# EAGLE design fischerbot (EAGLE 5.10)

## Sheet 1 of 2
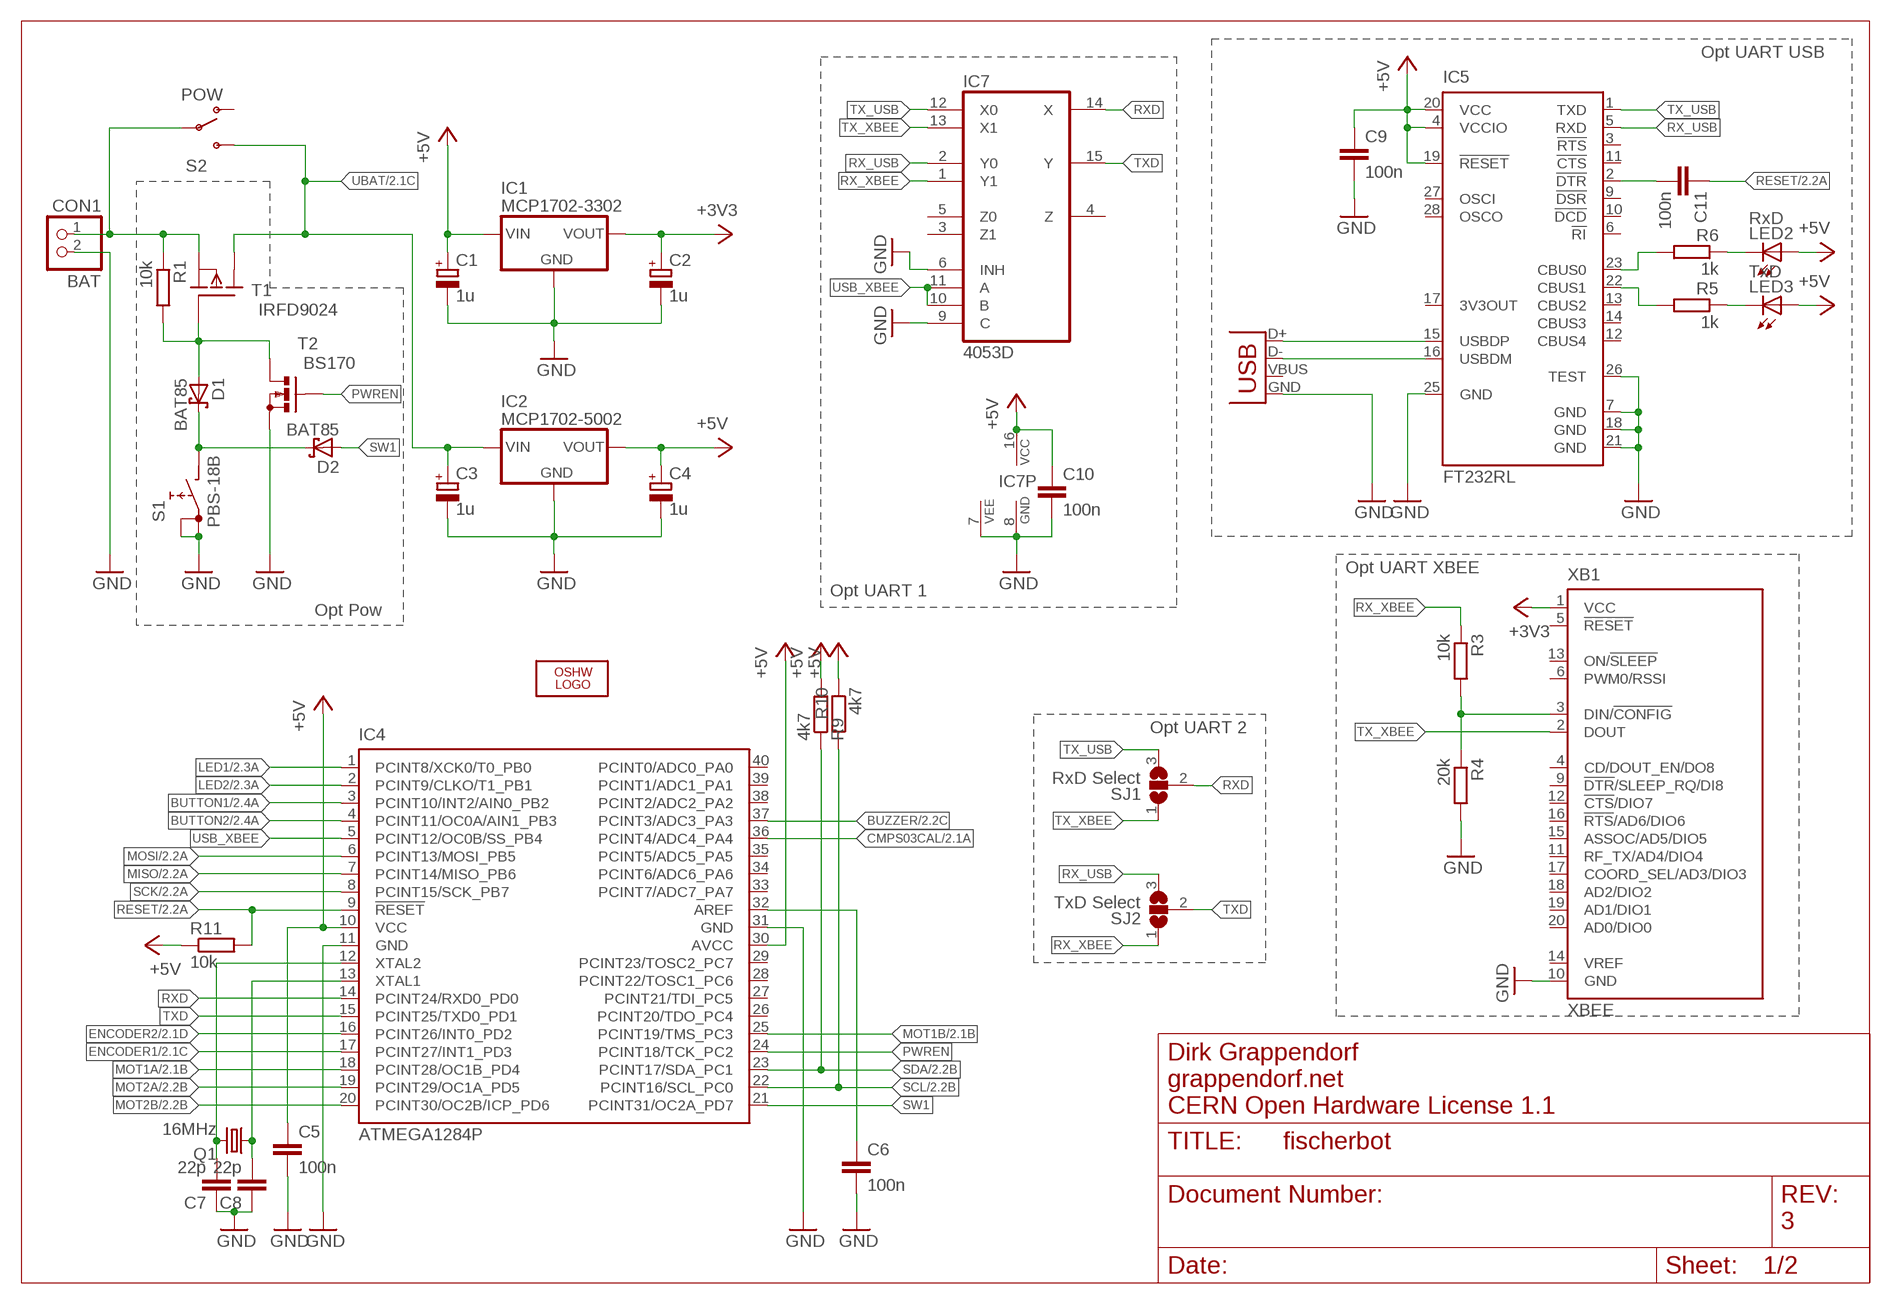
[diagram p0: schematic, sheet 1]

### Parts
C1  1u  CPOL-EUE2.5-5  [E2,5-5]
C2  1u  CPOL-EUE2.5-5  [E2,5-5]
C3  1u  CPOL-EUE2.5-5  [E2,5-5]
C4  1u  CPOL-EUE2.5-5  [E2,5-5]
C5  100n  C-EU025-024X044  [C025-024X044]
C6  100n  C-EU025-024X044  [C025-024X044]
C7  22p  C-EU025-024X044  [C025-024X044]
C8  22p  C-EU025-024X044  [C025-024X044]
C9  100n  C-EUC1206  [C1206]
C10  100n  C-EUC1206  [C1206]
C11  100n  C-EUC1206  [C1206]
CON1  BAT  PINHD-1X2_2.54-90°  [1X02/90]
D1  BAT85  1N5817-B  [DO41-7.6]
D2  BAT85  1N5817-B  [DO41-7.6]
IC1  MCP1702-3302  MCP1702  [MCP1702]
IC2  MCP1702-5002  MCP1702  [MCP1702]
IC4  ATMEGA1284P  ATMEGA644-20PU  [DIL40]
IC5  FT232RL  [SSOP28]
IC7  4053D  [SO16]
LED2  RxD  LEDCHIPLED_1206  [CHIPLED_1206]
LED3  TxD  LEDCHIPLED_1206  [CHIPLED_1206]
LOGO1  OSHW_LOGO_10MILX0350-NT  [OSHW_10X350_NOTEXT]
Q1  16MHz  CRYSTALHC49U-V  [HC49U-V]
R1  10k  R-EU_0204/7  [0204/7]
R3  10k  R-EU_0204/7  [0204/7]
R4  20k  R-EU_0204/7  [0204/7]
R5  1k  R-EU_R1206  [R1206]
R6  1k  R-EU_R1206  [R1206]
R9  4k7  R-EU_0204/7  [0204/7]
R10  4k7  R-EU_0204/7  [0204/7]
R11  10k  R-EU_0204/7  [0204/7]
S1  PBS-18B  [PBS-18B]
S2  POW  SWITCH-SPSTPTH  [SWITCH-SPDT]
SJ1  RxD Select  SJ2W  [SJ_2]
SJ2  TxD Select  SJ2W  [SJ_2]
T1  IRFD9024  [DIL04]
T2  BS170  [SOT54E]
X1  USB-SMD-NS  [USB-MINIB-NOSTOP]
XB1  XBEE  [XBEE]

### Nets
+3V3: C2.+ IC1.VOUT(OUT) XB1.1(VCC)
+5V: C1.+ C4.+ C5.1 C9.1 C10.1 IC1.VIN(IN) IC2.VOUT(OUT) IC4.10(VCC) IC4.30(AVCC) IC5.4(VCCIO) IC5.19(!RESET) IC5.20(VCC) IC7.16(VCC) LED2.A LED3.A R9.2 R10.1 R11.1 ; also sheet 2
BUTTON1: IC4.3(PCINT10/INT2/AIN0_PB2) ; also sheet 2
BUTTON2: IC4.4(PCINT11/OC0A/AIN1_PB3) ; also sheet 2
BUZZER: IC4.37(PCINT3/ADC3_PA3) ; also sheet 2
CMPS03CAL: IC4.36(PCINT4/ADC4_PA4) ; also sheet 2
ENCODER1: IC4.17(PCINT27/INT1_PD3) ; also sheet 2
ENCODER2: IC4.16(PCINT26/INT0_PD2) ; also sheet 2
GND: C1.- C2.- C3.- C4.- C5.2 C6.2 C7.1 C8.1 C9.2 C10.2 CON1.2 IC1.GND IC2.GND IC4.11(GND) IC4.31(GND) IC5.7(GND) IC5.18(GND) IC5.21(GND) IC5.25(GND) IC5.26(TEST) IC7.6(INH) IC7.7(VEE) IC7.8(GND) IC7.9(C) R4.2 S1.A S1.A1 T2.S X1.GND XB1.10(GND) ; also sheet 2
LED1: IC4.1(PCINT8/XCK0/T0_PB0) ; also sheet 2
LED2: IC4.2(PCINT9/CLKO/T1_PB1) ; also sheet 2
MISO: IC4.7(PCINT14/MISO_PB6) ; also sheet 2
MOSI: IC4.6(PCINT13/MOSI_PB5) ; also sheet 2
MOT1A: IC4.18(PCINT28/OC1B_PD4) ; also sheet 2
MOT1B: IC4.25(PCINT19/TMS_PC3) ; also sheet 2
MOT2A: IC4.19(PCINT29/OC1A_PD5) ; also sheet 2
MOT2B: IC4.20(PCINT30/OC2B/ICP_PD6) ; also sheet 2
N$1: C6.1 IC4.32(AREF)
N$3: D1.A R1.2 T1.1(G) T2.D
N$4: CON1.1 R1.1 S2.2(P) T1.2(S)
N$5: D1.C D2.C S1.B
N$7: R3.2 R4.1 XB1.3(DIN/!CONFIG)
N$10: IC5.23(CBUS0) R6.2
N$11: C7.2 IC4.12(XTAL2) Q1.2
N$12: IC5.22(CBUS1) R5.2
N$13: IC5.16(USBDM) X1.D-
N$14: IC5.15(USBDP) X1.D+
N$15: C8.2 IC4.13(XTAL1) Q1.1
N$16: LED2.C R6.1
N$17: LED3.C R5.1
N$26: C11.2 IC5.2(!DTR)
PWREN: IC4.24(PCINT18/TCK_PC2) T2.G
RESET: C11.1 IC4.9(!RESET) R11.2 ; also sheet 2
RX_USB: IC5.5(RXD) IC7.2(Y0) SJ2.3
RX_XBEE: IC7.1(Y1) R3.1 SJ2.1
RXD: IC4.14(PCINT24/RXD0_PD0) IC7.14(X) SJ1.2
SCK: IC4.8(PCINT15/SCK_PB7) ; also sheet 2
SCL: IC4.22(PCINT16/SCL_PC0) R10.2 ; also sheet 2
SDA: IC4.23(PCINT17/SDA_PC1) R9.1 ; also sheet 2
SW1: D2.A IC4.21(PCINT31/OC2A_PD7)
TX_USB: IC5.1(TXD) IC7.12(X0) SJ1.3
TX_XBEE: IC7.13(X1) SJ1.1 XB1.2(DOUT)
TXD: IC4.15(PCINT25/TXD0_PD1) IC7.15(Y) SJ2.2
UBAT: C3.+ IC2.VIN(IN) S2.3(S) T1.3(D1) ; also sheet 2
USB_XBEE: IC4.5(PCINT12/OC0B/SS_PB4) IC7.10(B) IC7.11(A)
Unconnected: IC4.26(PCINT20/TDO_PC4) IC4.27(PCINT21/TDI_PC5) IC4.28(PCINT22/TOSC1_PC6) IC4.29(PCINT23/TOSC2_PC7) IC4.33(PCINT7/ADC7_PA7) IC4.34(PCINT6/ADC6_PA6) IC4.35(PCINT5/ADC5_PA5) IC4.38(PCINT2/ADC2_PA2) IC4.39(PCINT1/ADC1_PA1) IC4.40(PCINT0/ADC0_PA0) IC5.3(!RTS) IC5.6(!RI) IC5.9(!DSR) IC5.10(!DCD) IC5.11(!CTS) IC5.12(CBUS4) IC5.13(CBUS2) IC5.14(CBUS3) IC5.17(3V3OUT) IC5.27(OSCI) IC5.28(OSCO) IC7.3(Z1) IC7.4(Z) IC7.5(Z0) S2.1(O) T1.4(D) X1.VBUS XB1.4(CD/DOUT_EN/DO8) XB1.5(!RESET) XB1.6(PWM0/RSSI) XB1.9(!DTR!/SLEEP_RQ/DI8) XB1.11(RF_TX/AD4/DIO4) XB1.12(!CTS!/DIO7) XB1.13(ON/!SLEEP) XB1.14(VREF) XB1.15(ASSOC/AD5/DIO5) XB1.16(!RTS!/AD6/DIO6) XB1.17(COORD_SEL/AD3/DIO3) XB1.18(AD2/DIO2) XB1.19(AD1/DIO1) XB1.20(AD0/DIO0)

### Notes on the sheet
- Opt UART USB
- Opt UART XBEE
- Opt UART 1
- Opt Pow
- Opt UART 2
- Dirk Grappendorf
- grappendorf.net
- CERN Open Hardware License 1.1
- 3

## Sheet 2 of 2
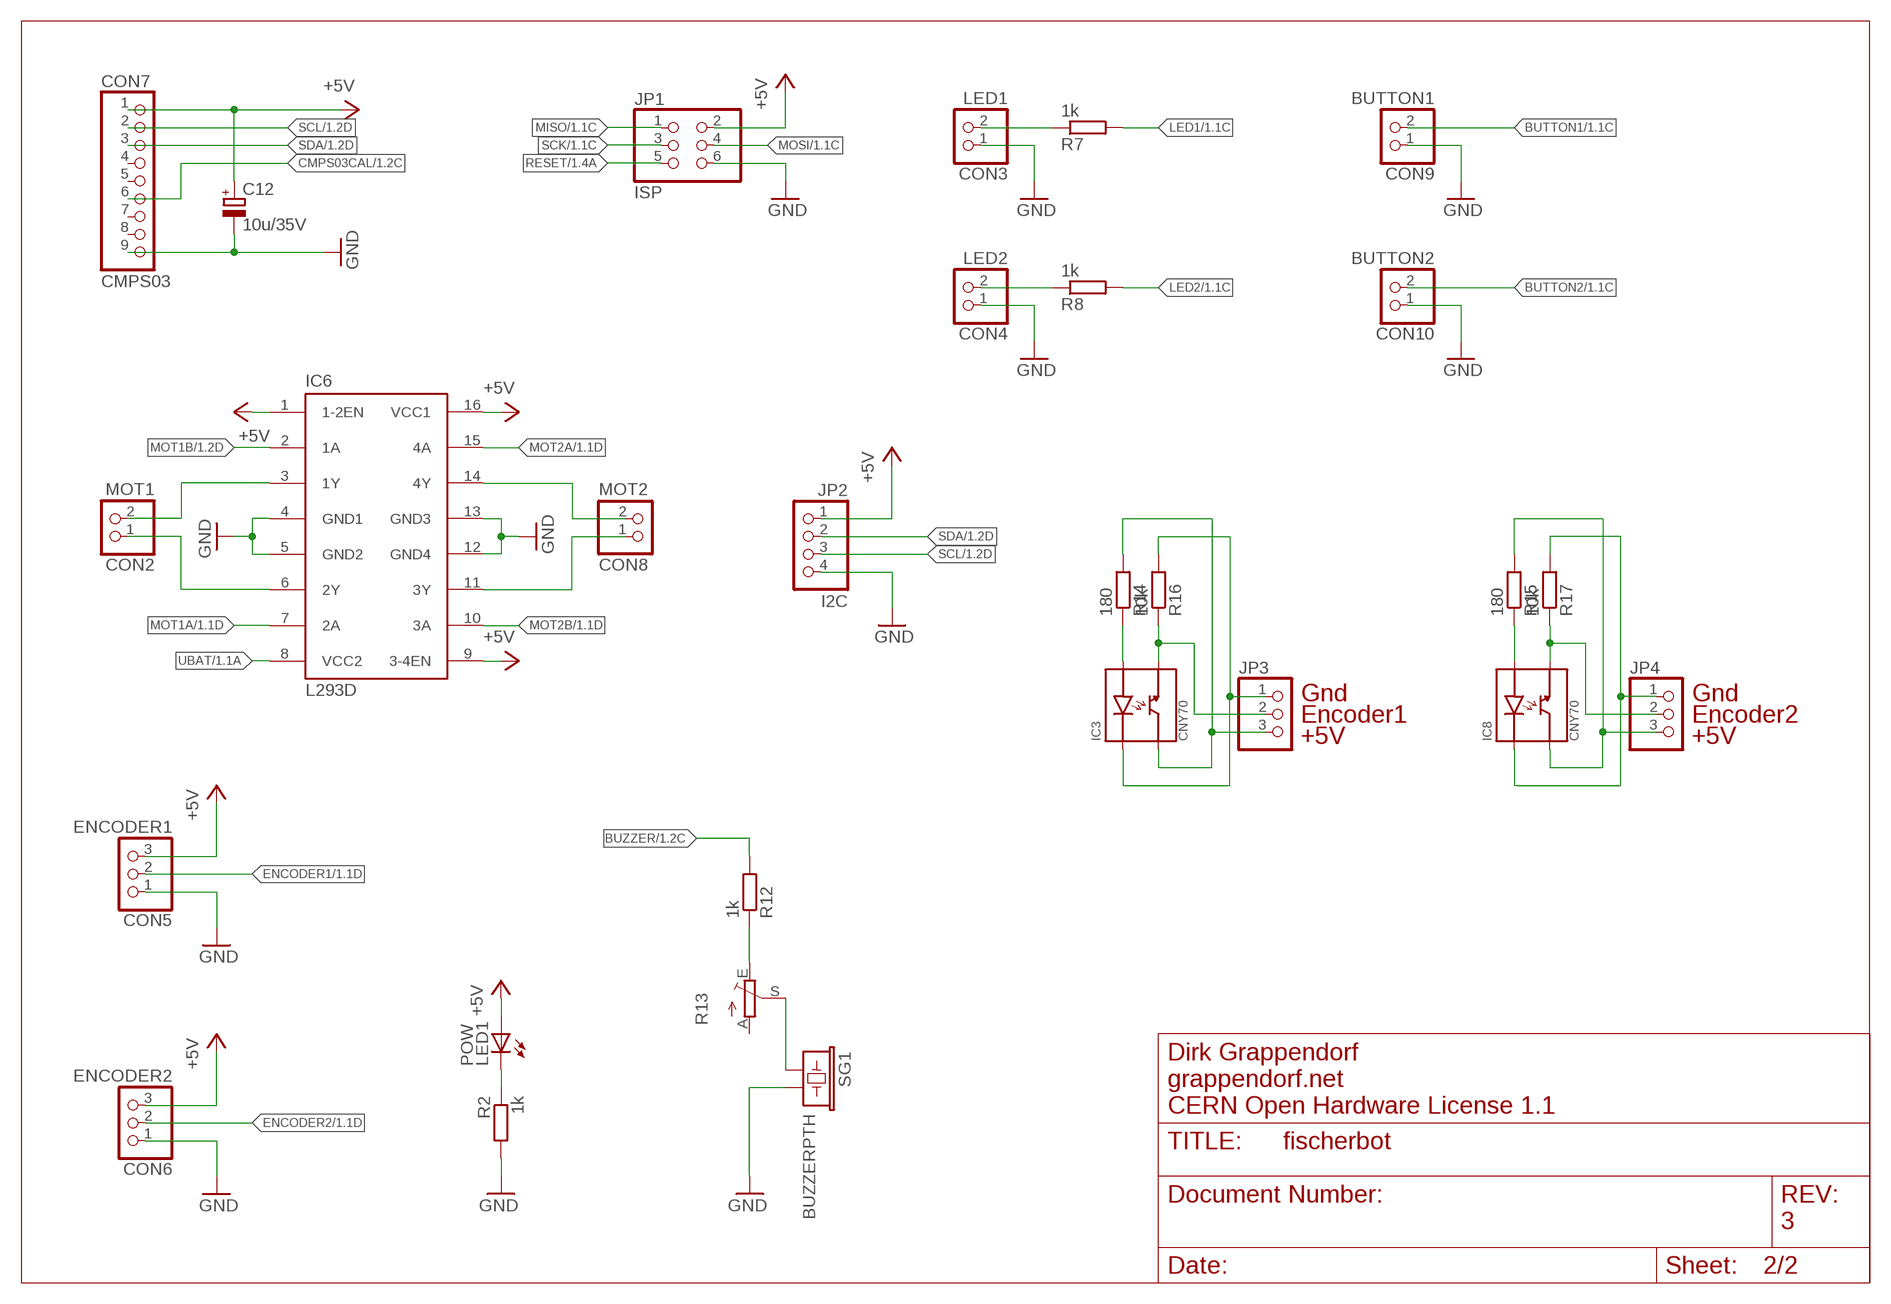
[diagram p1: schematic, sheet 2]

### Parts
C12  10u/35V  CPOL-EUE2.5-5  [E2,5-5]
CON2  MOT1  PINHD-1X2/90  [1X02/90]
CON3  LED1  PINHD-1X2/90  [1X02/90]
CON4  LED2  PINHD-1X2/90  [1X02/90]
CON5  ENCODER1  PINHD-1X3/90  [1X03/90]
CON6  ENCODER2  PINHD-1X3/90  [1X03/90]
CON7  CMPS03  PINHD-1X9  [1X09]
CON8  MOT2  PINHD-1X2/90  [1X02/90]
CON9  BUTTON1  PINHD-1X2/90  [1X02/90]
CON10  BUTTON2  PINHD-1X2/90  [1X02/90]
IC3  CNY70  [CNY70]
IC6  L293D  [DIL16]
IC8  CNY70  [CNY70]
JP1  ISP  PINHD-2X3_2.54  [2X03]
JP2  I2C  PINHD-1X4/90  [1X04/90]
JP3  PINHD-1X3  [1X03]
JP4  PINHD-1X3  [1X03]
LED1  POW  LED3MM  [LED3MM]
R2  1k  R-EU_0204/7  [0204/7]
R7  1k  R-EU_0204/7  [0204/7]
R8  1k  R-EU_0204/7  [0204/7]
R12  1k  R-EU_0204/7  [0204/7]
R13  TRIM_EU-ECP10S  [ECP10S]
R14  180  R-EU_0204/7  [0204/7]
R15  180  R-EU_0204/7  [0204/7]
R16  10k  R-EU_0204/7  [0204/7]
R17  10k  R-EU_0204/7  [0204/7]
SG1  BUZZERPTH  [BUZZER-12MM]

### Nets
+5V: C12.+ CON5.3 CON6.3 CON7.1 IC6.1(1-2EN) IC6.9(3-4EN) IC6.16(VCC1) JP1.2 JP2.1 LED1.A ; also sheet 1
BUTTON1: CON9.2 ; also sheet 1
BUTTON2: CON10.2 ; also sheet 1
BUZZER: R12.2 ; also sheet 1
CMPS03CAL: CON7.6 ; also sheet 1
ENCODER1: CON5.2 ; also sheet 1
ENCODER2: CON6.2 ; also sheet 1
GND: C12.- CON3.1 CON4.1 CON5.1 CON6.1 CON7.9 CON9.1 CON10.1 IC6.4(GND1) IC6.5(GND2) IC6.12(GND4) IC6.13(GND3) JP1.6 JP2.4 R2.2 SG1.- ; also sheet 1
LED1: R7.2 ; also sheet 1
LED2: R8.2 ; also sheet 1
MISO: JP1.1 ; also sheet 1
MOSI: JP1.4 ; also sheet 1
MOT1A: IC6.7(2A) ; also sheet 1
MOT1B: IC6.2(1A) ; also sheet 1
MOT2A: IC6.15(4A) ; also sheet 1
MOT2B: IC6.10(3A) ; also sheet 1
N$2: CON2.2 IC6.3(1Y)
N$6: LED1.K(C) R2.1
N$8: CON3.2 R7.1
N$9: CON4.2 R8.1
N$20: CON2.1 IC6.6(2Y)
N$21: CON8.2 IC6.14(4Y)
N$22: CON8.1 IC6.11(3Y)
N$30: R13.S SG1.+
N$31: R12.1 R13.E
N$32: IC3.EA R14.1
N$33: IC8.EA R15.1
N$34: IC3.DE JP3.2 R16.1
N$35: IC8.DE JP4.2 R17.1
N$40: IC8.EK JP4.1 R17.2
N$41: IC8.DC JP4.3 R15.2
N$46: IC3.DC JP3.3 R14.2
N$48: IC3.EK JP3.1 R16.2
RESET: JP1.5 ; also sheet 1
SCK: JP1.3 ; also sheet 1
SCL: CON7.2 JP2.3 ; also sheet 1
SDA: CON7.3 JP2.2 ; also sheet 1
UBAT: IC6.8(VCC2) ; also sheet 1
Unconnected: CON7.4 CON7.5 CON7.7 CON7.8 R13.A

### Notes on the sheet
- Gnd | Gnd
- Encoder1 | Encoder2
- +5V | +5V
- Dirk Grappendorf
- grappendorf.net
- CERN Open Hardware License 1.1
- 3

## Library data of the parts
C1-C4 C12 = rcl:CPOL-EU: POLARIZED CAPACITOR, European symbol
C5-C11 = rcl:C-EU: CAPACITOR, European symbol
CON1 = pinhead-1:PINHD-1X2: PIN HEADER
CON2-CON4 CON8-CON10 = pinhead:PINHD-1X2: PIN HEADER
CON5 CON6 JP3 JP4 = pinhead:PINHD-1X3: PIN HEADER
CON7 = pinhead:PINHD-1X9: PIN HEADER
D1 D2 = diode:1N581*: 1.0A SCHOTTKY BARRIER RECTIFIER Source: http://www.diodes.com/datasheets/ds23001.pdf
IC1 IC2 = grapelabs:MCP1702: VOLTAGE REGULATOR
IC3 IC8 = CNY70:CNY70: CNY70 (Vishay) Reflexkoppler
IC4 = atmel:ATMEGA644-*PU: 8-bit Microcontroller with 64K Bytes In-System Programmable Flash Auto generated by make-symbol-device-package-bsdl.ulp Rev. 34 Source: http://www.atmel.com/dyn/resources/prod_documents/doc2593.pdf
IC5 = ftdichip:FT232R: Source: http://www.ftdichip.com/Documents/DataSheets/DS_FT232R_v104.pdf
IC6 = st-microelectronics:L293D: PUSH-PULL 4 CHANNEL DRIVER
IC7 = 40xx:4053: Triple 2-channel ANALOG MULTIPLEXER
JP1 = pinhead-1:PINHD-2X3: PIN HEADER
JP2 = pinhead:PINHD-1X4: PIN HEADER
LED1-LED3 = led:LED: LED OSRAM: - CHIPLED LG R971, LG N971, LY N971, LG Q971, LY Q971, LO R971, LY R971 LH N974, LH R974 LS Q976, LO Q976, LY Q976 LO Q996 - Hyper CHIPLED LW Q18S LB Q993, LB Q99A, LB R99A - SideLED LS A670, LO A670, LY A670, LG A670, LP A670 LB A673, LV A673, LT A673, LW A673 LH A674 LY A675 LS A676, LA A676, LO A676, LY A676, LW A676 LS A679, LY A679, LG A679 - Hyper Micro SIDELED® LS Y876, LA Y876, LO Y876, LY Y876 LT Y87S - SmartLED LW L88C, LW L88S LB L89C, LB L89S, LG L890 LS L89K, LO L89K, LY L89K LS L896, LA L896, LO L896, LY L896 - TOPLED LS T670, LO T670, LY T670, LG T670, LP T670 LSG T670, LSP T670, LSY T670, LOP T670, LYG T670 LG T671, LOG T671, LSG T671 LB T673, LV T673, LT T673, LW T673 LH T674 LS T676, LA T676, LO T676, LY T676, LB T676, LH T676, LSB T676, LW T676 LB T67C, LV T67C, LT T67C, LS T67K, LO T67K, LY T67K, LW E67C LS E67B, LA E67B, LO E67B, LY E67B, LB E67C, LV E67C, LT E67C LW T67C LS T679, LY T679, LG T679 LS T770, LO T770, LY T770, LG T770, LP T770 LB T773, LV T773, LT T773, LW T773 LH T774 LS E675, LA E675, LY E675, LS T675 LS T776, LA T776, LO T776, LY T776, LB T776 LHGB T686 LT T68C, LB T68C - Hyper Mini TOPLED® LB M676 - Mini TOPLED Santana® LG M470 LS M47K, LO M47K, LY M47K Source: http://www.osram.convergy.de LUXEON: - LUMILED® LXK2-PW12-R00, LXK2-PW12-S00, LXK2-PW14-U00, LXK2-PW14-V00 LXK2-PM12-R00, LXK2-PM12-S00, LXK2-PM14-U00 LXK2-PE12-Q00, LXK2-PE12-R00, LXK2-PE12-S00, LXK2-PE14-T00, LXK2-PE14-U00 LXK2-PB12-K00, LXK2-PB12-L00, LXK2-PB12-M00, LXK2-PB14-N00, LXK2-PB14-P00, LXK2-PB14-Q00 LXK2-PR12-L00, LXK2-PR12-M00, LXK2-PR14-Q00, LXK2-PR14-R00 LXK2-PD12-Q00, LXK2-PD12-R00, LXK2-PD12-S00 LXK2-PH12-R00, LXK2-PH12-S00 LXK2-PL12-P00, LXK2-PL12-Q00, LXK2-PL12-R00 Source: www.luxeon.com KINGBRIGHT: KA-3528ASYC Source: www.kingbright.com
LOGO1 = OSHW:OSHW_LOGO_10MIL
Q1 = crystal:CRYSTAL: CRYSTAL
R1-R12 R14-R17 = rcl:R-EU_: RESISTOR, European symbol
R13 = pot:TRIM_EU-: POTENTIOMETER
S1 = grapelabs:PBS-18B: PUSH SWITCH www.radiohm.com
S2 = SparkFun:SWITCH-SPST: SPST Switch Simple slide switch. Spark Fun Electronics SKU : COM-00102
SG1 = SparkFun:BUZZER: Buzzer 12mm Spark Fun Electronics SKU : Comp-Buzzer
SJ1 SJ2 = jumper:SJ2W: SMD solder JUMPER
T1 = grapelabs:IRFD9024: P-Channel Enhancement MOSFET
T2 = transistor-small-signal:BS170: N-CHANNEL MOS FET
X1 = SparkFun:USB: USB Connectors USB-B-PTH is fully proven SKU : PRT-00139 USB-miniB is fully proven SKU : PRT-00587 USB-A-PCB is untested. USB-A-H is throughly reviewed, but untested. Spark Fun Electronics SKU : PRT-00437 USB-B-SMT is throughly reviewed, but untested. Needs silkscreen touching up. USB-A-S has not been used/tested USB-MB-H has not been used/tested
XB1 = maxstream:XBEE: XBee (TM) /XBee-PRO(TM) OEM RF Modules Source: MaxStream, Inc. xbee_productmanual.pdf

## Board
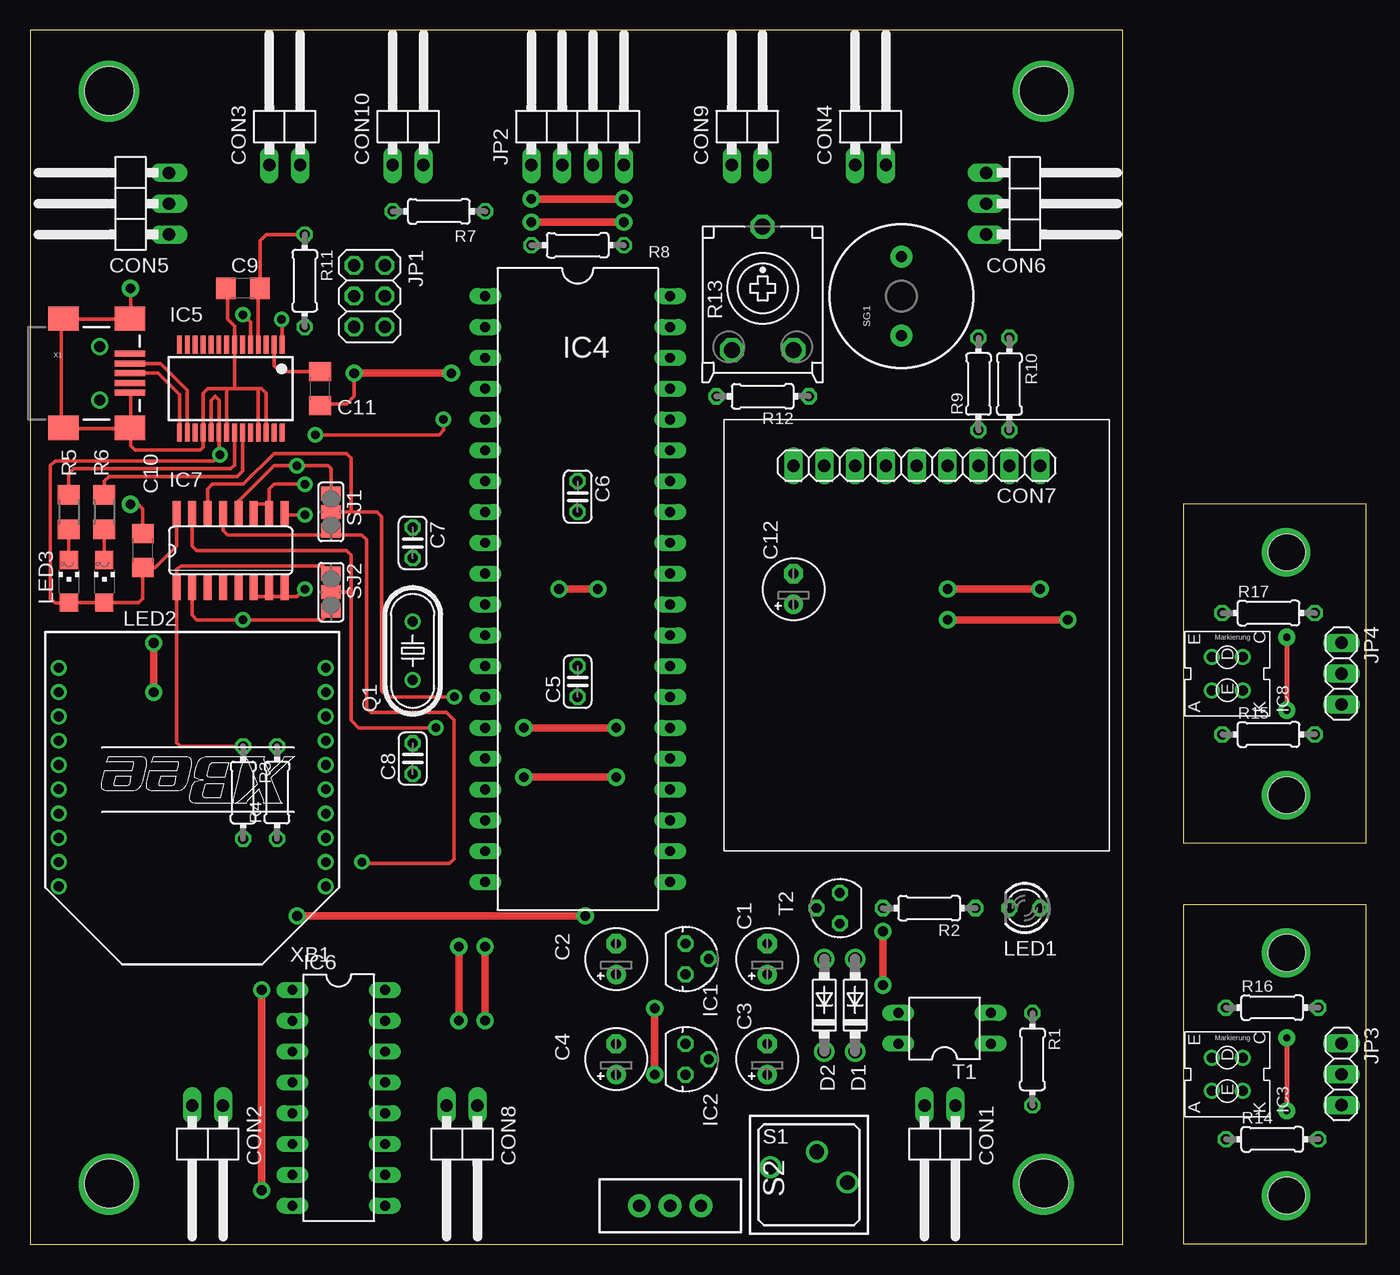
[diagram p2: board, top side]
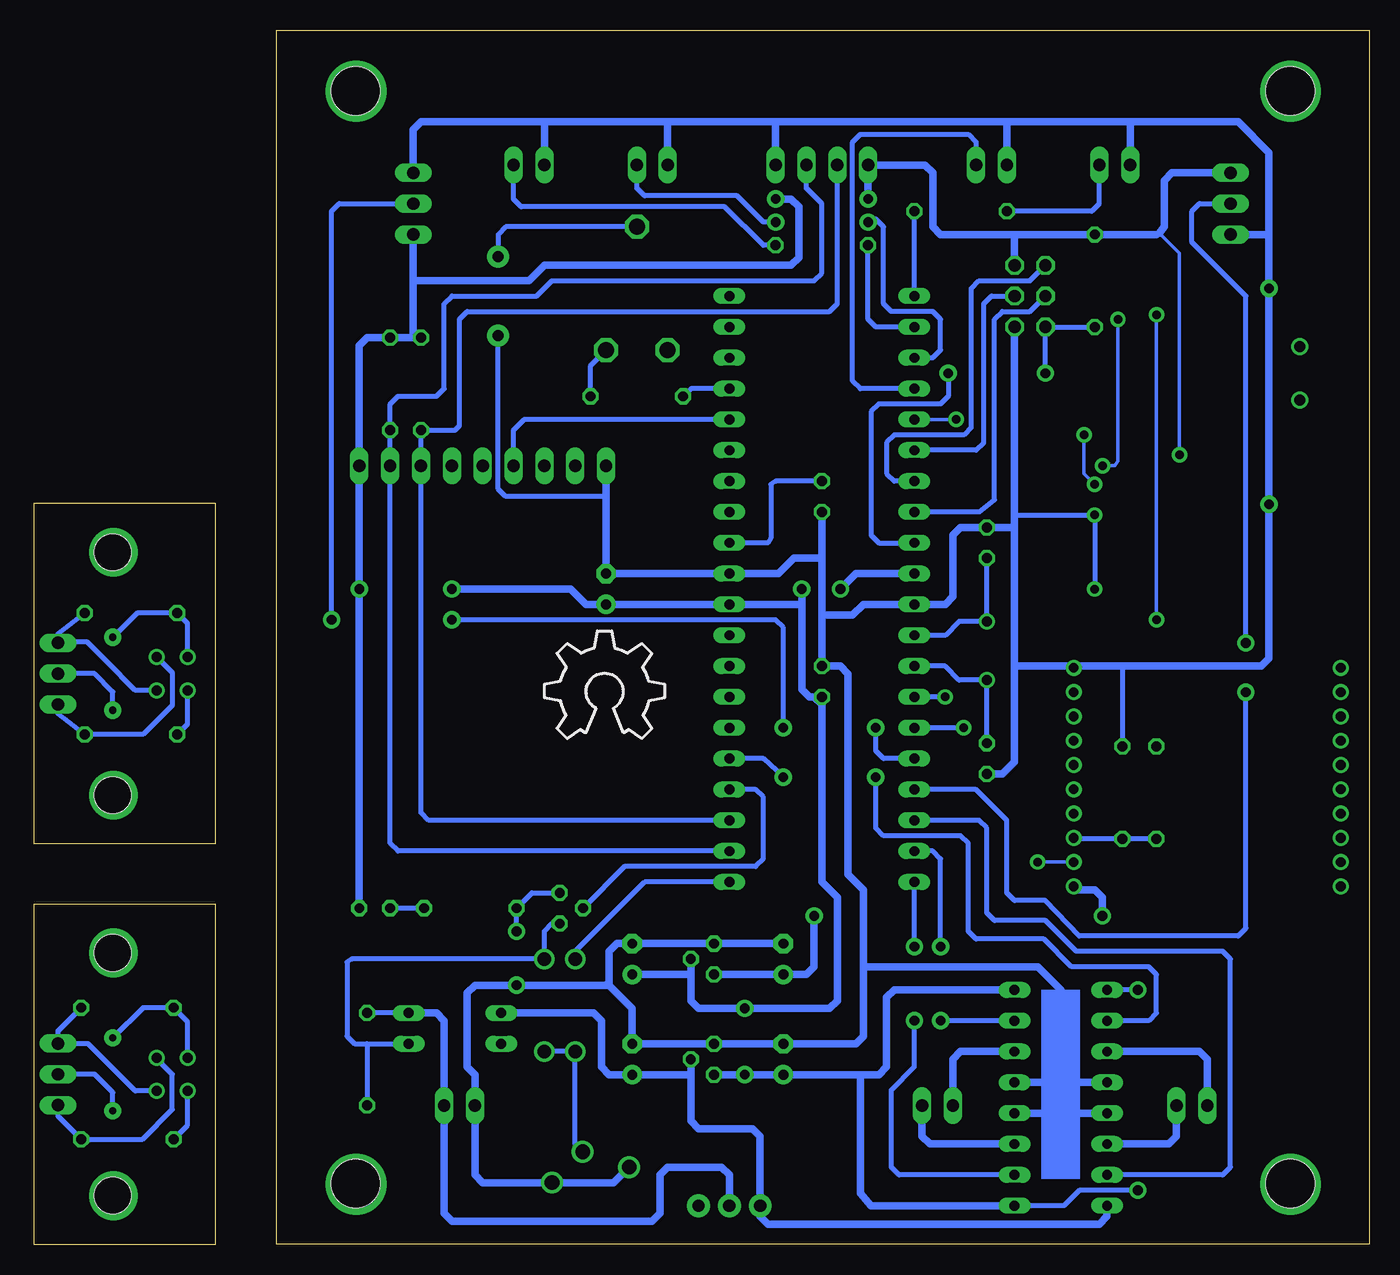
[diagram p3: board, bottom side, seen from below]

Size 110 x 100 mm. Coordinates in mm from the lower left corner, seen from the top.
Outline: 0,0 90,0 90,100 0,100 0,0
Outline: 95,61 110,61 110,33 95,33 95,61
Outline: 95,28 110,28 110,0 95,0 95,28
Copper layers (1*16): Top 0.035mm / dielectric 1.5mm / Bottom 0.035mm
Design rules "default *": minimum track width 10mil, minimum drill 24mil, track to track 8mil, track to pad 8mil, pad to pad 8mil, via to via 8mil, smd to smd 8mil, copper to edge 40mil, drill to drill 8mil, minimum pad ring 10mil, minimum via ring 8mil, stop-mask expansion 6mil, vias tented up to drill 0mil, thermal gap 10mil
Holes 4 mm at 6.5,95 6.5,5 83.5,5 83.5,95
Holes 3 mm at 103.5,57 103.5,37 103.5,24 103.5,4

### Footprints (pad centres in the part's own frame; a part is rotated, then mirrored left to right if it is on the bottom)
E2,5-5 = drill 0.813 pad 1.6 round: + -1.27,0 | drill 0.813 pad 1.6 octagon: - 1.27,0
C025-024X044 = drill 0.813 octagon: 1 -1.27,0; 2 1.27,0
C1206 = smd 1.6 x 1.8: 1 -1.4,0; 2 1.4,0
1X02/90 = drill 1.016 long: 1 -2.54,-3.81; 2 0,-3.81
1X02/90' = drill 1.016 long: 1 -1.27,-3.81; 2 1.27,-3.81
1X03/90 = drill 1.016 long: 1 -2.54,-3.81; 2 0,-3.81; 3 2.54,-3.81
1X09 = drill 1.016 long: 1 -10.16,0; 2 -7.62,0; 3 -5.08,0; 4 -2.54,0; 5 0,0; 6 2.54,0; 7 5.08,0; 8 7.62,0; 9 10.16,0
DO41-7.6 = drill 1.1 pad 1.7 round: A 3.81,0; C -3.81,0
MCP1702 = drill 0.813 octagon: GND -1.27,0; VIN 0,1.905; VOUT 1.27,0
CNY70 = drill 0.813 round: DC 1.37,-1.27; DE 1.37,1.27; EA -1.37,1.27; EK -1.37,-1.27
DIL40 = drill 0.813 long: 1 -24.13,-7.62; 2 -21.59,-7.62; 3 -19.05,-7.62; 4 -16.51,-7.62; 5 -13.97,-7.62; 6 -11.43,-7.62; 7 -8.89,-7.62; 8 -6.35,-7.62; 9 -3.81,-7.62; 10 -1.27,-7.62; 11 1.27,-7.62; 12 3.81,-7.62; 13 6.35,-7.62; 14 8.89,-7.62; 15 11.43,-7.62; 16 13.97,-7.62; 17 16.51,-7.62; 18 19.05,-7.62; 19 21.59,-7.62; 20 24.13,-7.62; 21 24.13,7.62; 22 21.59,7.62; 23 19.05,7.62; 24 16.51,7.62; 25 13.97,7.62; 26 11.43,7.62; 27 8.89,7.62; 28 6.35,7.62; 29 3.81,7.62; 30 1.27,7.62; 31 -1.27,7.62; 32 -3.81,7.62; 33 -6.35,7.62; 34 -8.89,7.62; 35 -11.43,7.62; 36 -13.97,7.62; 37 -16.51,7.62; 38 -19.05,7.62; 39 -21.59,7.62; 40 -24.13,7.62
SSOP28 = smd 0.4 x 1.5: 1 -4.225,-3.625; 2 -3.575,-3.625; 3 -2.925,-3.625; 4 -2.275,-3.625; 5 -1.625,-3.625; 6 -0.975,-3.625; 7 -0.325,-3.625; 8 0.325,-3.625; 9 0.975,-3.625; 10 1.625,-3.625; 11 2.275,-3.625; 12 2.925,-3.625; 13 3.575,-3.625; 14 4.225,-3.625; 15 4.225,3.625; 16 3.575,3.625; 17 2.925,3.625; 18 2.275,3.625; 19 1.625,3.625; 20 0.975,3.625; 21 0.325,3.625; 22 -0.325,3.625; 23 -0.975,3.625; 24 -1.625,3.625; 25 -2.275,3.625; 26 -2.925,3.625; 27 -3.575,3.625; 28 -4.225,3.625
DIL16 = drill 0.813 long: 1 -8.89,-3.81; 2 -6.35,-3.81; 3 -3.81,-3.81; 4 -1.27,-3.81; 5 1.27,-3.81; 6 3.81,-3.81; 7 6.35,-3.81; 8 8.89,-3.81; 9 8.89,3.81; 10 6.35,3.81; 11 3.81,3.81; 12 1.27,3.81; 13 -1.27,3.81; 14 -3.81,3.81; 15 -6.35,3.81; 16 -8.89,3.81
SO16 = smd 0.66 x 2.032: 1 -4.445,-3.073; 2 -3.175,-3.073; 3 -1.905,-3.073; 4 -0.635,-3.073; 5 0.635,-3.073; 6 1.905,-3.073; 7 3.175,-3.073; 8 4.445,-3.073; 9 4.445,3.073; 10 3.175,3.073; 11 1.905,3.073; 12 0.635,3.073; 13 -0.635,3.073; 14 -1.905,3.073; 15 -3.175,3.073; 16 -4.445,3.073
2X03 = drill 1.016 octagon: 1 -2.54,-1.27; 2 -2.54,1.27; 3 0,-1.27; 4 0,1.27; 5 2.54,-1.27; 6 2.54,1.27
1X04/90 = drill 1.016 long: 1 -3.81,-3.81; 2 -1.27,-3.81; 3 1.27,-3.81; 4 3.81,-3.81
1X03 = drill 1.016 long: 1 -2.54,0; 2 0,0; 3 2.54,0
LED3MM = drill 0.813 octagon: A -1.27,0; K 1.27,0
CHIPLED_1206 = smd 1.5 x 1.5: A 0,-1.75; C 0,1.75
HC49U-V = drill 0.813 round: 1 -2.413,0; 2 2.413,0
0204/7 = drill 0.813 octagon: 1 -3.81,0; 2 3.81,0
R1206 = smd 1.6 x 1.803: 1 -1.422,0; 2 1.422,0
ECP10S = drill 1.321 octagon: A -2.54,-5.08; E 2.54,-5.08; S 0,5.08
PBS-18B = drill 1.2 round: A 3.175,-0.635; A1 -3.175,0.635; B 0.65,1.9
SWITCH-SPDT = drill 1.016 pad 1.88 round: 1 0,2.54; 2 0,0; 3 0,-2.54
BUZZER-12MM = drill 0.9 pad 1.778 round: + 3.25,0; - -3.25,0
SJ_2 = smd 1.168 x 1.6: 1 -1.524,0; 2 0,0; 3 1.524,0
DIL04 = drill 0.813 long: 1 -1.27,-3.81; 2 1.27,-3.81; 3 1.27,3.81; 4 -1.27,3.81
SOT54E = drill 0.813 octagon: D -1.27,0; G 0,1.905; S 1.27,0
USB-MINIB-NOSTOP = smd 2.5 x 0.5: D+ 2.5,0; D- 2.5,0.8; GND 2.5,-1.6; ID 2.5,-0.8; VBUS 2.5,1.6 | smd 2.5 x 2: G1 -3,-4.5; G2 -3,4.5; G3 2.5,4.5; G4 2.5,-4.5 | drill 0.9 pad 0.8 round: H1 0,2.2 | drill 0.9 pad 0.787 round: H2 0,-2.2
XBEE = drill 0.8 pad 1.27 round: 1 -11,9; 2 -11,7; 3 -11,5; 4 -11,3; 5 -11,1; 6 -11,-1; 7 -11,-3; 8 -11,-5; 9 -11,-7; 10 -11,-9; 11 11,-9; 12 11,-7; 13 11,-5; 14 11,-3; 15 11,-1; 16 11,1; 17 11,3; 18 11,5; 19 11,7; 20 11,9

### Placement (x,y rotation side)
C1  60.71,23.5 90 top
C2  48.26,23.5 90 top
C3  60.71,15.24 90 top
C4  48.26,15.24 90 top
C5  45.09,46.35 90 top
C6  45.09,61.59 270 top
C7  31.5,57.78 270 top
C8  31.5,40.01 90 top
C9  17.53,78.74 180 top
C10  9.27,57.15 90 top
C11  23.88,70.48 90 top
C12  62.87,53.98 90 top
CON1  73.66,7.62 180 top
CON2  MOT1  [1X02/90']  14.61,7.62 180 top
CON3  LED1  [1X02/90']  20.95,92.71 0 top
CON4  LED2  [1X02/90']  69.22,92.71 0 top
CON5  7.62,85.72 90 top
CON6  82.55,85.72 270 top
CON7  73.03,64.14 180 top
CON8  MOT2  [1X02/90']  35.56,7.62 180 top
CON9  BUTTON1  [1X02/90']  59.05,92.71 0 top
CON10  BUTTON2  [1X02/90']  31.11,92.71 0 top
D1  67.94,19.68 90 top
D2  65.41,19.68 90 top
IC1  53.98,23.5 270 top
IC2  53.98,15.24 270 top
IC3  98.6,14 90 top
IC4  45.09,53.98 270 top
IC5  16.51,70.48 180 top
IC6  25.4,12.06 270 top
IC7  16.51,57.15 0 top
IC8  98.6,47 90 top
JP1  27.94,78.11 270 top
JP2  45.09,92.71 0 top
JP3  108,14 270 top
JP4  108,47 270 top
LED1  81.92,27.69 180 top
LED2  6.1,54.61 0 top
LED3  3.17,54.61 0 top
LOGO1  67.94,41.66 0 bottom
Q1  31.5,48.9 90 top
R1  82.55,15.24 270 top
R2  74.04,27.69 180 top
R3  17.53,37.21 270 top
R4  20.32,37.21 90 top
R5  3.17,60.33 90 top
R6  6.1,60.33 90 top
R7  33.66,85.09 0 top
R8  45.09,82.3 180 top
R9  78.11,70.87 90 top
R10  80.64,70.87 270 top
R11  22.61,79.38 270 top
R12  60.33,69.85 180 top
R13  60.33,78.74 0 top
R14  102.3,8.65 0 top
R15  102,42 0 top
R16  102.3,19.49 0 top
R17  102,52 0 top
S1  64.14,5.71 0 top
S2  52.7,3.17 270 top
SG1  71.75,78.11 90 top
SJ1  24.77,60.33 90 top
SJ2  24.77,53.72 270 top
T1  75.31,17.78 90 top
T2  66.67,27.69 90 top
X1  5.71,71.75 0 top
XB1  13.34,38.48 180 top

### Tracks (layer width: path | path; a pad name or v marks a point on that pad's centre or on a via)
+3V3  (via drill 0.8 pad 1.42)
  Top 0.61: v21.97,27.05 v45.72,27.05
  Bottom 0.61: IC1.VOUT C2.+ 46.35,22.23 45.72,22.86 v45.72,27.05 | v21.97,27.05 21.97,28.57 22.61,29.21 24.13,29.21 XB1.1
+5V  (via drill 0.7 pad 1.27, 0.8 pad 1.42)
  Top 0.305: IC7.16 12.06,57.53 10.29,55.75 C10.1 9.27,53.21 8.92,52.86 LED2.A LED3.A 3.15,52.83 2.03,52.83 1.65,53.21 1.65,64.14 2.03,64.52 15.11,64.52 v15.62,65.02 15.54,65.24 IC5.20 15.54,69.56 15.24,69.85 14.88,69.5 IC5.19 | C9.1 18.92,82.68 19.43,83.19 R11.1 | C9.1 18.8,78.36 | IC5.4 18.79,78.6 C9.1
  Top 0.61: v46.74,53.98 v43.56,53.98 | v51.44,13.97 v51.44,19.43 | v19.05,4.45 v19.05,20.95 | v41.27,86.11 v48.9,86.11 | v83.19,53.98 v75.56,53.98
  Bottom 0.305: v15.62,65.02 15.62,81.66 17.27,83.31
  Bottom 0.406: v19.05,20.95 IC6.1 | v19.05,4.45 23.88,4.45 25.15,3.17 IC6.9
  Bottom 0.61: 29.21,83.19 R11.1 17.53,83.19 17.27,83.31 16.89,83.82 16.89,87.63 16.26,88.27 CON5.3 | 29.21,83.19 JP1.2 | IC4.10 42.29,55.24 v43.56,53.98 | 45.72,45.09 46.1,45.09 46.74,45.72 46.74,52.7 | 45.72,45.09 C5.1 | 46.74,52.7 v46.74,53.98 | 46.74,52.7 IC4.30 C12.+ 64.52,52.7 65.79,53.98 v75.56,53.98 | 55.88,22.23 55.88,20.07 55.24,19.43 v51.44,19.43 44.45,19.43 43.81,20.07 43.81,28.57 45.09,29.84 45.09,44.45 45.72,45.09 | 55.88,22.23 IC1.VIN | IC2.VOUT v51.44,13.97 C4.+ 41.91,13.97 | 55.88,22.23 C1.+ | 29.21,83.19 35.31,83.19 35.94,83.82 35.94,88.27 36.58,88.9 JP2.1 v41.27,86.11 | IC6.16 39.12,20.95 39.75,20.32 39.75,14.61 40.39,13.97 41.91,13.97 | IC6.9 41.02,3.17 41.91,4.19 41.91,13.97 | LED1.A v83.19,53.98 CON7.1 83.19,74.04 82.55,74.68 R10.1 78.74,74.68 | v48.9,86.11 47.62,86.11 46.99,85.47 46.99,81.28 47.62,80.64 67.94,80.64 69.22,79.38 78.74,79.38 | CON6.3 78.74,79.76 78.74,79.38 | 78.74,74.68 R9.2 | 78.74,79.38 78.74,74.68
BUTTON1  (via drill 0.8 pad 1.42)
  Top 0.61: v41.27,84.2 v48.9,84.2
  Bottom 0.406: IC4.3 35.94,73.03 35.31,73.66 35.31,76.2 35.94,76.83 39.37,76.83 40.01,77.47 40.01,83.82 40.64,84.45 v41.27,84.2 | v48.9,84.2 49.91,84.2 52.07,86.36 59.69,86.36 60.33,87 CON9.2
BUTTON2
  Bottom 0.406: IC4.4 41.91,70.48 42.55,71.12 42.55,90.81 41.91,91.44 33.02,91.44 32.38,90.81 CON10.2
BUZZER
  Bottom 0.406: IC4.37 55.88,70.48 R12.2
CMPS03CAL
  Bottom 0.406: IC4.36 69.6,67.94 70.48,67.06 CON7.6
ENCODER1  (via drill 0.8 pad 1.42)
  Top 0.61: v10.16,45.47 v10.16,49.53
  Bottom 0.406: v10.16,45.47 10.16,26.04 10.79,25.4 23.88,25.4 26.67,28.32 29.21,28.32 29.84,28.96 29.84,34.92 32.38,37.47 IC4.17 | v10.16,49.53 10.16,78.11 14.61,82.55 14.61,85.09 13.97,85.72 CON5.2
ENCODER2  (via drill 0.8 pad 1.42)
  Top 0.61: v40.64,42.55 v48.26,42.55 | v75.56,51.44 v85.47,51.44
  Bottom 0.406: CON6.2 84.84,85.72 85.47,85.09 v85.47,51.44 | v48.26,42.55 48.26,50.8 48.9,51.44 v75.56,51.44 | IC4.16 40.01,40.01 40.64,40.64 v40.64,42.55
GND  (via drill 0.7 pad 1.27, 0.8 pad 1.42)
  Top 0.305: 18.41,53.34 19.68,53.34 20.95,53.34 21.97,53.34 v22.61,53.98 | 8.26,67.18 8.26,65.79 8.64,65.41 13.97,65.41 14.23,65.67 IC5.18 14.23,70.11 14.35,70.23 14.61,70.48 16.13,70.48 | v22.61,60.07 21.21,60.07 | v8.26,78.74 8.26,76.2 2.54,76.2 2.54,67.31 2.67,67.18 8.26,67.18 | IC5.26 19.43,70.1 19.05,70.48 18.8,70.48 18.67,70.48 | 16.13,70.48 16.26,70.48 | 16.26,70.48 16.76,70.48 | 16.76,70.48 16.89,70.48 | 16.89,70.48 18.67,70.48 | 16.13,70.48 16.26,70.48 | 16.76,70.48 16.89,70.48 | 16.26,78.23 C9.2 16.26,78.61 16.26,76.2 16.84,75.62 IC5.7 16.84,70.54 16.89,70.48 | 8.26,67.18 8.26,70.11 X1.GND | C10.2 9.27,60.58 8.89,60.96 v8.26,60.96 | IC5.21 16.18,70.41 16.26,70.48 | IC5.25 18.79,70.37 18.67,70.48
  Top 0.406: 18.41,53.34 IC7.6 | 19.68,53.34 IC7.7 | 20.95,53.34 IC7.8 | 21.21,60.07 IC7.9
  Top 0.61: v70.23,21.34 v70.23,25.78
  Bottom 0.406: v22.61,53.98 v22.61,60.07 29.21,60.07 | T2.S 68.96,28.96 R2.2 v70.23,25.78 | SG1.- 71.75,62.23 71.12,61.59 62.87,61.59 | 20.32,47.62 R4.2
  Bottom 0.61: CON6.1 78.74,91.82 78.11,92.46 67.94,92.46 | 19.68,92.46 10.79,92.46 8.26,89.92 8.26,83.19 | 19.68,92.46 29.84,92.46 | 29.84,92.46 48.9,92.46 | 48.9,92.46 57.78,92.46 | 57.78,92.46 67.94,92.46 | 19.68,92.46 CON3.1 | 29.84,92.46 CON10.1 | 67.94,92.46 CON4.1 | 57.78,92.46 CON9.1 | 48.9,92.46 JP2.4 | 45.09,51.82 C5.2 43.56,47.62 42.93,46.99 42.93,30.48 41.66,29.21 41.66,22.86 | 45.09,51.82 45.09,56.52 | 45.09,56.52 C6.2 | C2.- IC1.GND C1.- 61.98,24.77 62.61,24.13 62.61,21.59 62.74,21.46 | 8.26,61.59 v8.26,60.96 | 8.26,61.59 v8.26,78.74 8.26,83.19 | 8.26,83.19 CON5.1 | C8.1 30.23,38.73 29.21,39.75 29.21,47.62 | 41.66,22.86 41.66,17.14 42.29,16.51 C4.- IC2.GND C3.- 60.71,19.43 62.74,21.46 | 45.09,51.82 42.55,51.82 41.66,52.7 IC4.11 34.92,52.7 34.29,53.34 34.29,58.42 33.66,59.05 C7.1 29.21,59.05 | 45.09,56.52 47.37,56.52 48.64,55.24 IC4.31 61.98,55.24 | 25.4,13.34 IC6.4 | 25.4,13.34 IC6.13 | IC6.5 25.4,10.79 | 25.4,10.79 IC6.12 | 25.4,13.34 25.4,20.95 27.3,22.86 41.66,22.86 | 25.4,10.79 25.4,13.34 | 29.21,47.62 29.21,59.05 | 29.21,59.05 29.21,60.07 JP1.6 | 62.74,21.46 62.87,21.34 v70.23,21.34 73.66,21.34 74.3,20.7 74.3,14.61 73.66,13.97 CON1.2 73.66,5.71 73.03,5.08 S1.A 62.23,5.08 S1.A1 | C12.- 61.98,55.24 | C12.- 61.98,55.24 | C12.- 62.87,61.59 CON7.9 | 24.48,47.62 29.21,47.62 | 24.48,47.62 20.32,47.62 8.89,47.62 8.26,48.26 8.26,61.59 | 24.48,47.62 XB1.10
LED1
  Bottom 0.406: IC4.1 R7.2
LED2
  Bottom 0.406: IC4.2 40.64,75.56 41.27,76.2 R8.2
MISO
  Bottom 0.406: JP1.1 27.94,79.38 32.13,79.38 32.77,78.74 32.77,67.31 33.4,66.67 39.12,66.67 39.75,66.04 39.75,63.5 39.12,62.87 IC4.7
MOSI
  Bottom 0.406: JP1.4 31.11,78.11 31.75,77.47 31.75,66.04 32.38,65.41 IC4.6
MOT1A
  Bottom 0.406: IC6.7 12.06,5.71 11.43,6.35 11.43,23.5 12.06,24.13 24.13,24.13 26.67,26.67 30.86,26.67 31.5,27.3 31.5,34.29 32.13,34.92 IC4.18
MOT1B  (via drill 0.8 pad 1.42)
  Top 0.61: v40.64,38.48 v48.26,38.48
  Bottom 0.406: IC6.2 18.16,18.41 17.53,19.05 17.53,22.23 18.16,22.86 24.51,22.86 26.8,25.15 32.38,25.15 33.02,25.78 33.02,33.02 33.66,33.66 40.01,33.66 40.64,34.29 v40.64,38.48 | v48.26,38.48 49.91,40.01 IC4.25
MOT2A  (via drill 0.8 pad 1.42)
  Top 0.61: v35.31,18.41 v35.31,24.51
  Bottom 0.406: IC6.15 v35.31,18.41 | v35.31,24.51 35.31,31.75 35.94,32.38 IC4.19
MOT2B  (via drill 0.8 pad 1.42)
  Top 0.61: v37.47,18.41 v37.47,24.51
  Bottom 0.406: IC6.10 38.73,5.71 39.37,6.35 39.37,12.7 37.47,14.61 v37.47,18.41 | v37.47,24.51 IC4.20
N$1
  Bottom 0.406: C6.1 48.9,62.87 49.28,62.61 49.28,58.17 49.53,57.78 IC4.32
N$2
  Bottom 0.61: IC6.3 13.97,15.88 13.34,15.24 CON2.2
N$3
  Bottom 0.406: 82.55,16.51 83.57,16.51 84.2,17.14 84.2,23.24 83.82,23.5 D1.A 67.94,25.78 67.31,26.42 T2.D | 82.55,16.51 T1.1 | 82.55,16.51 R1.2
N$4
  Bottom 0.406: T1.2 R1.1
  Bottom 0.61: S2.2 52.7,5.71 53.34,6.35 57.78,6.35 58.42,5.71 58.42,2.54 59.05,1.91 75.56,1.91 76.2,2.54 CON1.1 76.2,18.41 76.83,19.05 T1.2
N$5
  Bottom 0.406: D1.C D2.C 65.41,8.23 S1.B
N$6
  Bottom 0.406: R2.1 LED1.K
N$7
  Bottom 0.406: R3.2 R4.1 24.26,33.4 XB1.3
N$8
  Bottom 0.406: R7.1 22.86,85.09 22.23,85.72 CON3.2
N$9
  Bottom 0.406: R8.1 49.91,82.3 53.09,85.47 69.85,85.47 70.48,86.11 CON4.2
N$10
  Top 0.305: IC5.23 17.48,63.71 17.14,63.37 17.02,63.25 6.48,63.25 6.1,62.87 R6.2
N$11
  Bottom 0.406: IC4.12 34.92,50.16 33.78,51.31 Q1.2 C7.2
N$12
  Top 0.305: R5.2 3.17,63.5 3.56,63.88 16.51,63.88 16.84,64.21 IC5.22
N$13
  Top 0.305: X1.D- 10.76,72.56 10.92,72.39 12.94,70.38 IC5.16
N$14
  Top 0.305: X1.D+ 10.54,71.75 12.29,70.01 IC5.15
N$15
  Bottom 0.406: IC4.13 34.92,47.62 33.78,46.48 Q1.1 C8.2
N$16
  Top 0.305: LED2.C R6.1
N$17
  Top 0.305: LED3.C R5.1
N$18  (via drill 4)
  other vias: 6.48,4.95
N$19  (via drill 4)
  other vias: 83.44,4.95
N$20
  Bottom 0.61: CON2.1 15.88,8.89 16.51,8.26 IC6.6
N$21
  Bottom 0.61: IC6.14 33.66,15.88 34.29,15.24 CON8.2
N$22
  Bottom 0.61: IC6.11 36.2,8.26 36.83,8.89 CON8.1
N$23  (via drill 4)
  other vias: 83.44,95
N$24  (via drill 4)
  other vias: 6.48,95
N$25  (via drill 0.8)
  other vias: 6.48,95
N$26
  Top 0.305: 23.62,72.14 C11.2 20.57,71.89 20.32,72.14 | IC5.2 20.09,72.37 20.32,72.14 | 20.32,72.14 20.45,72.01
N$27  (via drill 0.8)
  other vias: 83.44,95
N$28  (via drill 0.8)
  other vias: 6.48,4.95
N$29  (via drill 0.8)
  other vias: 83.44,4.95
N$30
  Bottom 0.406: R13.S 71.12,83.82 71.75,83.19 SG1.+
N$31
  Bottom 0.406: R12.1 64.14,72.39 R13.E
N$32
  Bottom 0.406: IC3.EA 97.33,9.81 R14.1
N$33
  Bottom 0.406: IC8.EA 97.33,42.86 R15.1
N$34  (via drill 0.6 pad 1.42)
  Top 0.406: v103.5,17 v103.5,11
  Bottom 0.406: v103.5,17 101.01,19.49 R16.1 97.33,18.33 IC3.DE | v103.5,11 103.5,12.5 105,14 JP3.2
N$35  (via drill 0.6 pad 1.42)
  Top 0.406: v103.5,50 v103.5,44
  Bottom 0.406: v103.5,44 103.5,45.5 105,47 JP4.2 | IC8.DE 97.33,51.14 R17.1 101.5,52 v103.5,50
N$36  (via drill 3)
  other vias: 103.44,57
N$37  (via drill 0.8)
  other vias: 103.44,57
N$38  (via drill 3)
  other vias: 103.44,37
N$39  (via drill 0.8)
  other vias: 103.44,37
N$40
  Bottom 0.406: R17.2 108,50.31 JP4.1 107.94,49.6 105.6,49.6 104,48 101.63,45.63 IC8.EK
N$41
  Bottom 0.406: JP4.3 108,43.69 R15.2 101,42 98.6,44.4 98.6,47.1 IC8.DC
N$42  (via drill 3)
  other vias: 103.44,24
N$43  (via drill 0.8)
  other vias: 103.44,24
N$44  (via drill 3)
  other vias: 103.44,4
N$45  (via drill 0.8)
  other vias: 103.44,4
N$46
  Bottom 0.406: JP3.3 108,10.54 R14.2 101.05,8.65 98.6,11.1 98.6,14 99.87,15.27 IC3.DC
N$48
  Bottom 0.406: R16.2 108,17.6 JP3.1 105.54,16.54 104,15 101.63,12.63 IC3.EK
PWREN
  Bottom 0.406: T2.G 61.34,31.11 50.55,31.11 49.91,31.75 49.91,36.83 50.55,37.47 IC4.24
RESET  (via drill 0.8 pad 1.42)
  Top 0.305: C11.1 24,69.22 26.04,69.22 26.67,69.85 v26.67,71.75
  Top 0.61: v26.67,71.75 v34.67,71.75
  Bottom 0.406: R11.2 JP1.5 v26.67,71.75 | IC4.9 40.39,57.78 41.02,58.42 41.02,68.58 40.39,69.22 35.31,69.22 34.67,69.85 v34.67,71.75
RX_USB  (via drill 0.7 pad 1.27)
  Top 0.305: IC7.2 13.34,51.82 13.72,51.44 v17.53,51.44 24,51.44 SJ2.3 | IC5.5 18.14,75.97 v17.53,76.58
  Bottom 0.305: v17.53,51.44 v17.53,76.58
RX_XBEE
  Top 0.305: 24.51,55.5 SJ2.1 24.13,55.88 12.45,55.88 12.06,55.63 IC7.1 12.06,41.27 12.45,41.02 R3.1
  Top 0.406: 24.51,55.5 24.51,55.63
RXD  (via drill 0.7 pad 1.27)
  Top 0.305: v34.92,45.09 29.46,45.09 28.96,45.59 28.96,59.94 28.57,60.33 26.42,60.33 | 26.42,60.33 SJ1.2 | IC7.14 14.61,62.23 14.99,62.61 17.53,62.61 20.07,65.15 26.04,65.15 26.42,64.77 26.42,60.33
  Bottom 0.406: v34.92,45.09 IC4.14
SCK
  Bottom 0.406: JP1.3 27.94,76.83 30.23,76.83 30.86,76.2 30.86,61.34 32.13,60.33 IC4.8
SCL
  Bottom 0.406: JP2.3 46.35,87 45.09,85.72 45.09,80.01 45.72,79.38 67.31,79.38 68.58,78.11 75.56,78.11 76.2,77.47 76.2,70.48 76.83,69.85 80.01,69.85 80.64,69.22 R10.2 CON7.2 80.64,33.02 80.01,32.38 IC4.22
SDA
  Bottom 0.406: IC4.23 77.47,34.92 78.11,35.56 CON7.3 R9.1 75.31,67.06 74.93,67.44 74.93,76.2 74.3,76.83 44.45,76.83 43.81,77.47 JP2.2
SW1
  Bottom 0.406: D2.A 65.41,24.13 59.69,29.84 IC4.21
TX_USB  (via drill 0.7 pad 1.27)
  Top 0.305: SJ1.3 24.77,61.98 24.77,63.88 24.51,64.14 v21.97,64.14 20.07,64.14 17.14,61.21 IC7.12 | IC5.1 20.73,76.17 v20.7,76.2
  Top 0.406: 24.77,61.98 SJ1.3
  Bottom 0.305: v20.7,76.2 20.7,64.52 20.95,64.14 v21.97,64.14
TX_XBEE  (via drill 0.7 pad 1.27)
  Top 0.305: IC7.13 15.88,58.8 16.26,58.42 24.38,58.42 27.3,58.42 27.69,58.04 27.69,44.2 28.07,43.81 34.29,43.81 34.92,43.18 34.92,31.75 34.54,31.37 27.3,31.37 v27.3,31.5
  Top 0.406: 24.38,58.42 SJ1.1
  Bottom 0.305: v27.3,31.5 24.38,31.5 XB1.2
TXD  (via drill 0.7 pad 1.27)
  Top 0.305: 26.42,53.72 SJ2.2 | IC7.15 13.34,57.53 13.72,57.15 26.04,57.15 26.42,56.77 26.42,53.72 | 26.42,53.72 26.42,43.18 27.05,42.55 v33.4,42.55
  Bottom 0.406: v33.4,42.55 IC4.15
UBAT
  Bottom 0.61: 55.88,13.97 55.88,10.16 55.24,9.53 50.8,9.53 50.16,8.89 S2.3 50.16,2.29 49.53,1.65 22.23,1.65 21.59,2.29 IC6.8 | 55.88,13.97 IC2.VIN | 55.88,13.97 C3.+ 62.61,13.97 63.25,14.61 63.25,18.41 63.88,19.05 T1.3
USB_XBEE  (via drill 0.7 pad 1.27)
  Top 0.305: v23.5,66.67 33.66,66.67 34.04,67.06 v34.04,67.94 | 19.68,60.96 IC7.10 | 19.68,60.96 19.68,62.23 20.07,62.61 v22.61,62.61 | IC7.11 18.41,60.96 19.68,60.96
  Bottom 0.305: v23.5,66.67 23.5,63.5 v22.61,62.61 | v34.04,67.94 IC4.5
(copper drawn outside any net)
  shapes: Bottom area x1

### Text on the board
tDocu: FischerBot V3 | grappendorf.net 2011